# Altium schematic sheet 01 POWER.SchDoc
size A4
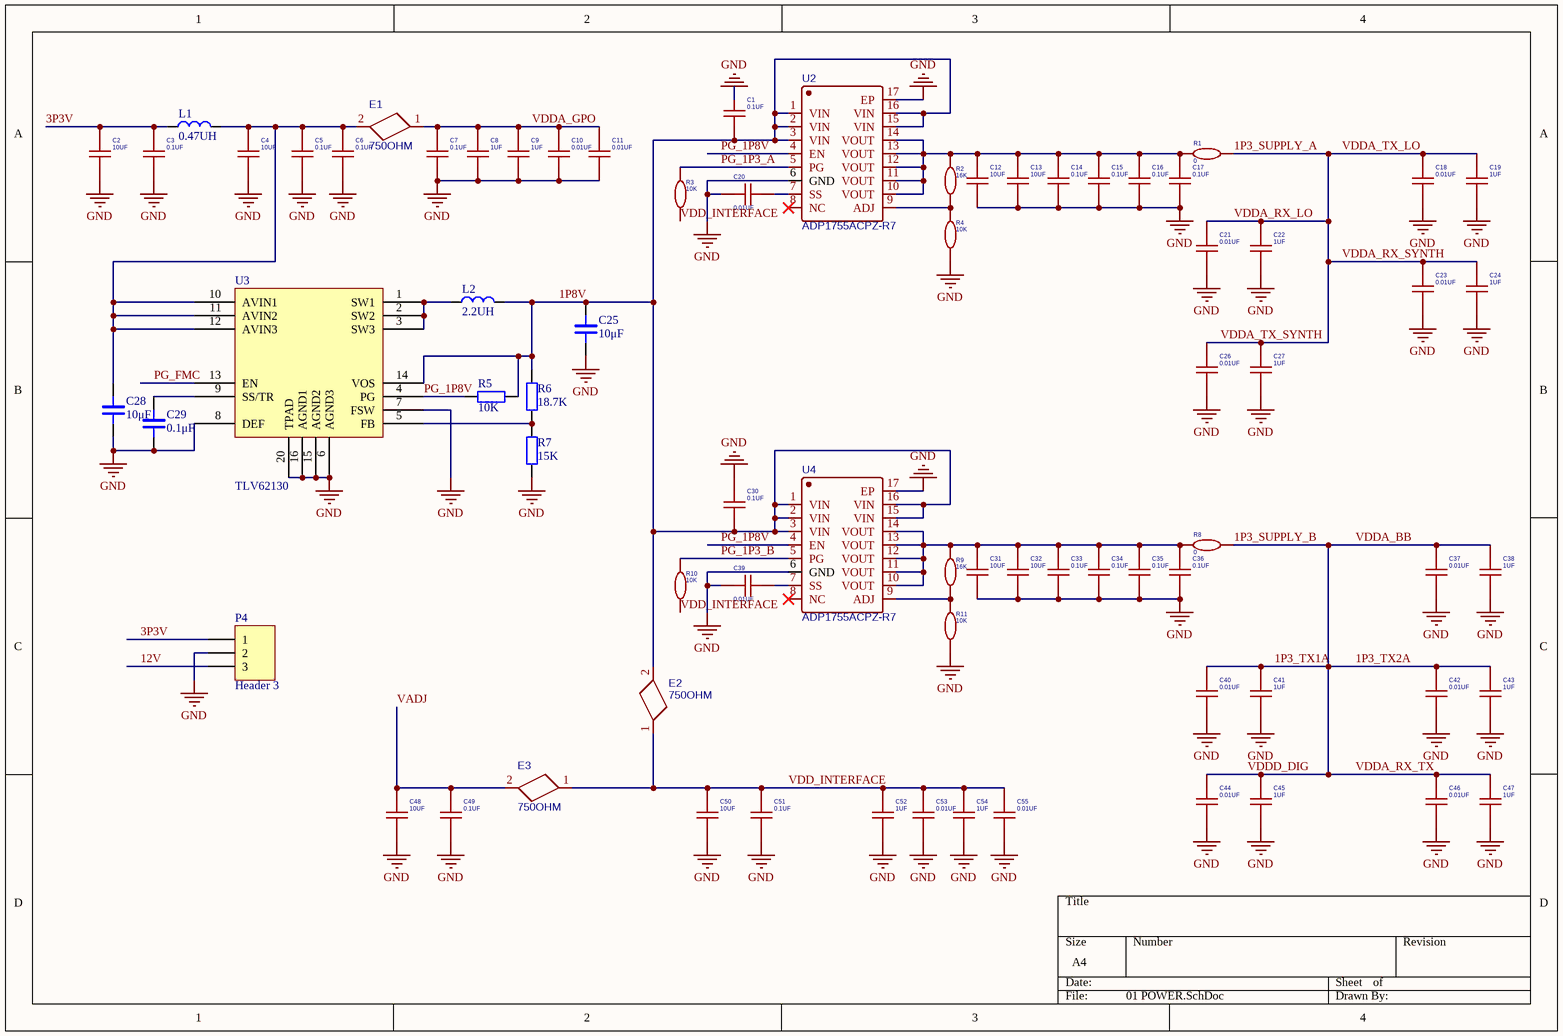
[diagram p0: 01 POWER.SchDoc]

## Parts
C1  0.1UF  [C0402]
C2  10UF  [C0402]
C3  0.1UF  [C0402]
C4  10UF  [C0402]
C5  0.1UF  [C0402]
C6  0.1UF  [C0402]
C7  0.1UF  [C0402]
C8  1UF  [C0402]
C9  1UF  [C0402]
C10  0.01UF  [C0201]
C11  0.01UF  [C0201]
C12  10UF  [C0402]
C13  10UF  [C0402]
C14  0.1UF  [C0402]
C15  0.1UF  [C0402]
C16  0.1UF  [C0402]
C17  0.1UF  [C0402]
C18  0.01UF  [C0201]
C19  1UF  [C0402]
C20  0.01UF  [C0201]
C21  0.01UF  [C0201]
C22  1UF  [C0402]
C23  0.01UF  [C0201]
C24  1UF  [C0402]
C25  10μF  [C0402]
C26  0.01UF  [C0201]
C27  1UF  [C0402]
C28  10μF  [C0402]
C29  0.1μF  [C0402]
C30  0.1UF  [C0402]
C31  10UF  [C0402]
C32  10UF  [C0402]
C33  0.1UF  [C0402]
C34  0.1UF  [C0402]
C35  0.1UF  [C0402]
C36  0.1UF  [C0402]
C37  0.01UF  [C0402]
C38  1UF  [C0402]
C39  0.01UF  [C0402]
C40  0.01UF  [C0402]
C41  1UF  [C0402]
C42  0.01UF  [C0201]
C43  1UF  [C0402]
C44  0.01UF  [C0201]
C45  1UF  [C0402]
C46  0.01UF  [C0402]
C47  1UF  [C0402]
C48  10UF  [C0603]
C49  0.1UF  [C0402]
C50  10UF  [C0402]
C51  0.1UF  [C0201]
C52  1UF  [C0402]
C53  0.01UF  [C0201]
C54  1UF  [C0402]
C55  0.01UF  [C0201]
E1  750OHM  [L0402]
E2  750OHM  [L0402]
E3  750OHM  [L0402]
L1  0.47UH  [L1008]
L2  2.2UH  [L1008]
P4  Header 3  [CNBERG1X3H205LD36]
R1  0  [R1206]
R2  16K  [LC-0402_R]
R3  10K  [C0201]
R4  10K  [LC-0402_R]
R5  10K  [LC-0402_R]
R6  18.7K  [LC-0402_R]
R7  15K  [LC-0402_R]
R8  0  [R1206]
R9  16K  [LC-0402_R]
R10  10K  [LC-0402_R]
R11  10K  [LC-0402_R]
U2  ADP1755ACPZ-R7  [LFCSP-WQ-16_L4.0-W4.0-P0.65-EP2.3-BL-EP]
U3  TLV62130  [TLV62130RGT]
U4  ADP1755ACPZ-R7  [LFCSP-WQ-16_L4.0-W4.0-P0.65-EP2.3-BL-EP]

## Nets
GND: C1.1 C2.2 C3.2 C4.2 C5.2 C6.2 C7.2 C8.2 C9.2 C10.2 C11.2 C12.2 C13.2 C14.2 C15.2 C16.2 C17.2 C18.2 C19.2 C20.2 C21.2 C22.2 C23.2 C24.2 C25.1 C26.2 C27.2 C28.1 C29.1 C30.1 C31.2 C32.2 C33.2 C34.2 C35.2 C36.2 C37.2 C38.2 C39.2 C40.2 C41.2 C42.2 C43.2 C44.2 C45.2 C46.2 C47.2 C48.2 C49.2 C50.2 C51.2 C52.2 C53.2 C54.2 C55.2 P4.2 R4.1 R7.2 R11.1 U2.6(GND) U2.17(EP) U3.6(AGND3) U3.7(FSW) U3.8(DEF) U3.15(AGND2) U3.16(AGND1) U3.20(TPAD) U4.6(GND) U4.17(EP)
1P3_SUPPLY_A: C18.1 C19.1 C21.1 C22.1 C23.1 C24.1 C26.1 C27.1 R1.2  [also labelled VDDA_RX_LO, VDDA_RX_SYNTH, VDDA_TX_LO, VDDA_TX_SYNTH]
1P3_SUPPLY_B: C37.1 C38.1 C40.1 C41.1 C42.1 C43.1 C44.1 C45.1 C46.1 C47.1 R8.2  [also labelled 1P3_TX1A, 1P3_TX2A, VDDA_BB, VDDA_RX_TX, VDDD_DIG]
1P8V: C1.2 C25.2 C30.2 E2.2 L2.2 R5.1 R6.1 U2.1(VIN) U2.2(VIN) U2.3(VIN) U2.15(VIN) U2.16(VIN) U3.14(VOS) U4.1(VIN) U4.2(VIN) U4.3(VIN) U4.15(VIN) U4.16(VIN)
3P3V: C2.1 C3.1 L1.1 P4.1
12V: P4.3
PG_1P3_A: R3.2 U2.5(PG)
PG_1P3_B: R10.2 U4.5(PG)
PG_1P8V: R5.2 U2.4(EN) U3.4(PG) U4.4(EN)
PG_FMC: U3.13(EN)
VADJ: C48.1 C49.1 E3.2
VDD_INTERFACE: C50.1 C51.1 C52.1 C53.1 C54.1 C55.1 E2.1 E3.1 R3.1 R10.1
VDDA_GPO: C7.1 C8.1 C9.1 C10.1 C11.1 E1.1
NetC4_1: C4.1 C5.1 C6.1 C28.2 E1.2 L1.2 U3.10(AVIN1) U3.11(AVIN2) U3.12(AVIN3)
NetC12_1: C12.1 C13.1 C14.1 C15.1 C16.1 C17.1 R1.1 R2.2 U2.10(VOUT) U2.11(VOUT) U2.12(VOUT) U2.13(VOUT) U2.14(VOUT)
NetC20_1: C20.1 U2.7(SS)
NetC29_2: C29.2 U3.9(SS/TR)
NetC31_1: C31.1 C32.1 C33.1 C34.1 C35.1 C36.1 R8.1 R9.2 U4.10(VOUT) U4.11(VOUT) U4.12(VOUT) U4.13(VOUT) U4.14(VOUT)
NetC39_1: C39.1 U4.7(SS)
NetL2_1: L2.1 U3.1(SW1) U3.2(SW2) U3.3(SW3)
NetR2_1: R2.1 R4.2 U2.9(ADJ)
NetR6_2: R6.2 R7.1 U3.5(FB)
NetR9_1: R9.1 R11.2 U4.9(ADJ)

Not connected (* = marked no-connect by the designer): U2 8(NC)*; U4 8(NC)*

## Library data of the parts
C1 C3 C5-C7 C14-C17 C30 C33-C36 C49 C51 = 0.1UF: BOM_Manufacturer: WTC; BOM_Manufacturer Part: 0402B104K160; nameAlias: Capacitance; BOM_Supplier: LCSC; BOM_Supplier Part: C83056; spicePre: C; spiceSymbolName: 0402B104K160
C2 C4 C8-C13 C18 C19 C21-C24 C26 C27 C31 C32 C37 C38 C40-C48 C50 C52-C55 = 10UF: BOM_Manufacturer: WTC; BOM_Manufacturer Part: 0402B104K160; nameAlias: Capacitance; BOM_Supplier: LCSC; BOM_Supplier Part: C83056; spicePre: C; spiceSymbolName: 0402B104K160
C20 C39 = 0.01UF: BOM_Manufacturer: WTC; BOM_Manufacturer Part: 0402B104K160; nameAlias: Capacitance; BOM_Supplier: LCSC; BOM_Supplier Part: C83056; spicePre: C; spiceSymbolName: 0402B104K160
C25 C28 C29 = CAP_3: Capacitor
E1-E3 = 100OHM: BOM_Manufacturer: Murata; BOM_Manufacturer Part: BLM21PG221SN1x; Contributor: prophetC; BOM_Supplier: LCSC; spicePre: L; spiceSymbolName: 220ohm at 100MHz
L1 L2 = INDUCTANCE_1: Inductance
P4 = Header 3: Header, 3-Pin; LatestRevisionDate: 17-Jul-2002; LatestRevisionNote: Re-released for DXP Platform.; Publisher: Altium Limited
R1 R8 = 1: BOM_Manufacturer: YAGEO; BOM_Manufacturer Part: RC0402FR-0780R6L; nameAlias: Resistance (Ohms); Contributor: LCSC; BOM_Supplier: LCSC; BOM_Supplier Part: C185392; spicePre: R; spiceSymbolName: RC0402FR-0780R6L
R2-R4 R9-R11 = 10K: BOM_Manufacturer: YAGEO; BOM_Manufacturer Part: RC0402FR-0780R6L; nameAlias: Resistance (Ohms); Contributor: LCSC; BOM_Supplier: LCSC; BOM_Supplier Part: C185392; spicePre: R; spiceSymbolName: RC0402FR-0780R6L
R5-R7 = RES: Resistor
U2 U4 = ADP1755ACPZ-R7: BOM_Manufacturer: Analog Devices; Contributor: LCSC; BOM_Paste Type: expand; BOM_Supplier: LCSC; BOM_Supplier Part: C403695; BOM_Manufacturer Part: ADP1755ACPZ-R7; spicePre: U; spiceSymbolName: ADP1755ACPZ-R7